# Altium project PulseGenBoard.PrjPcb
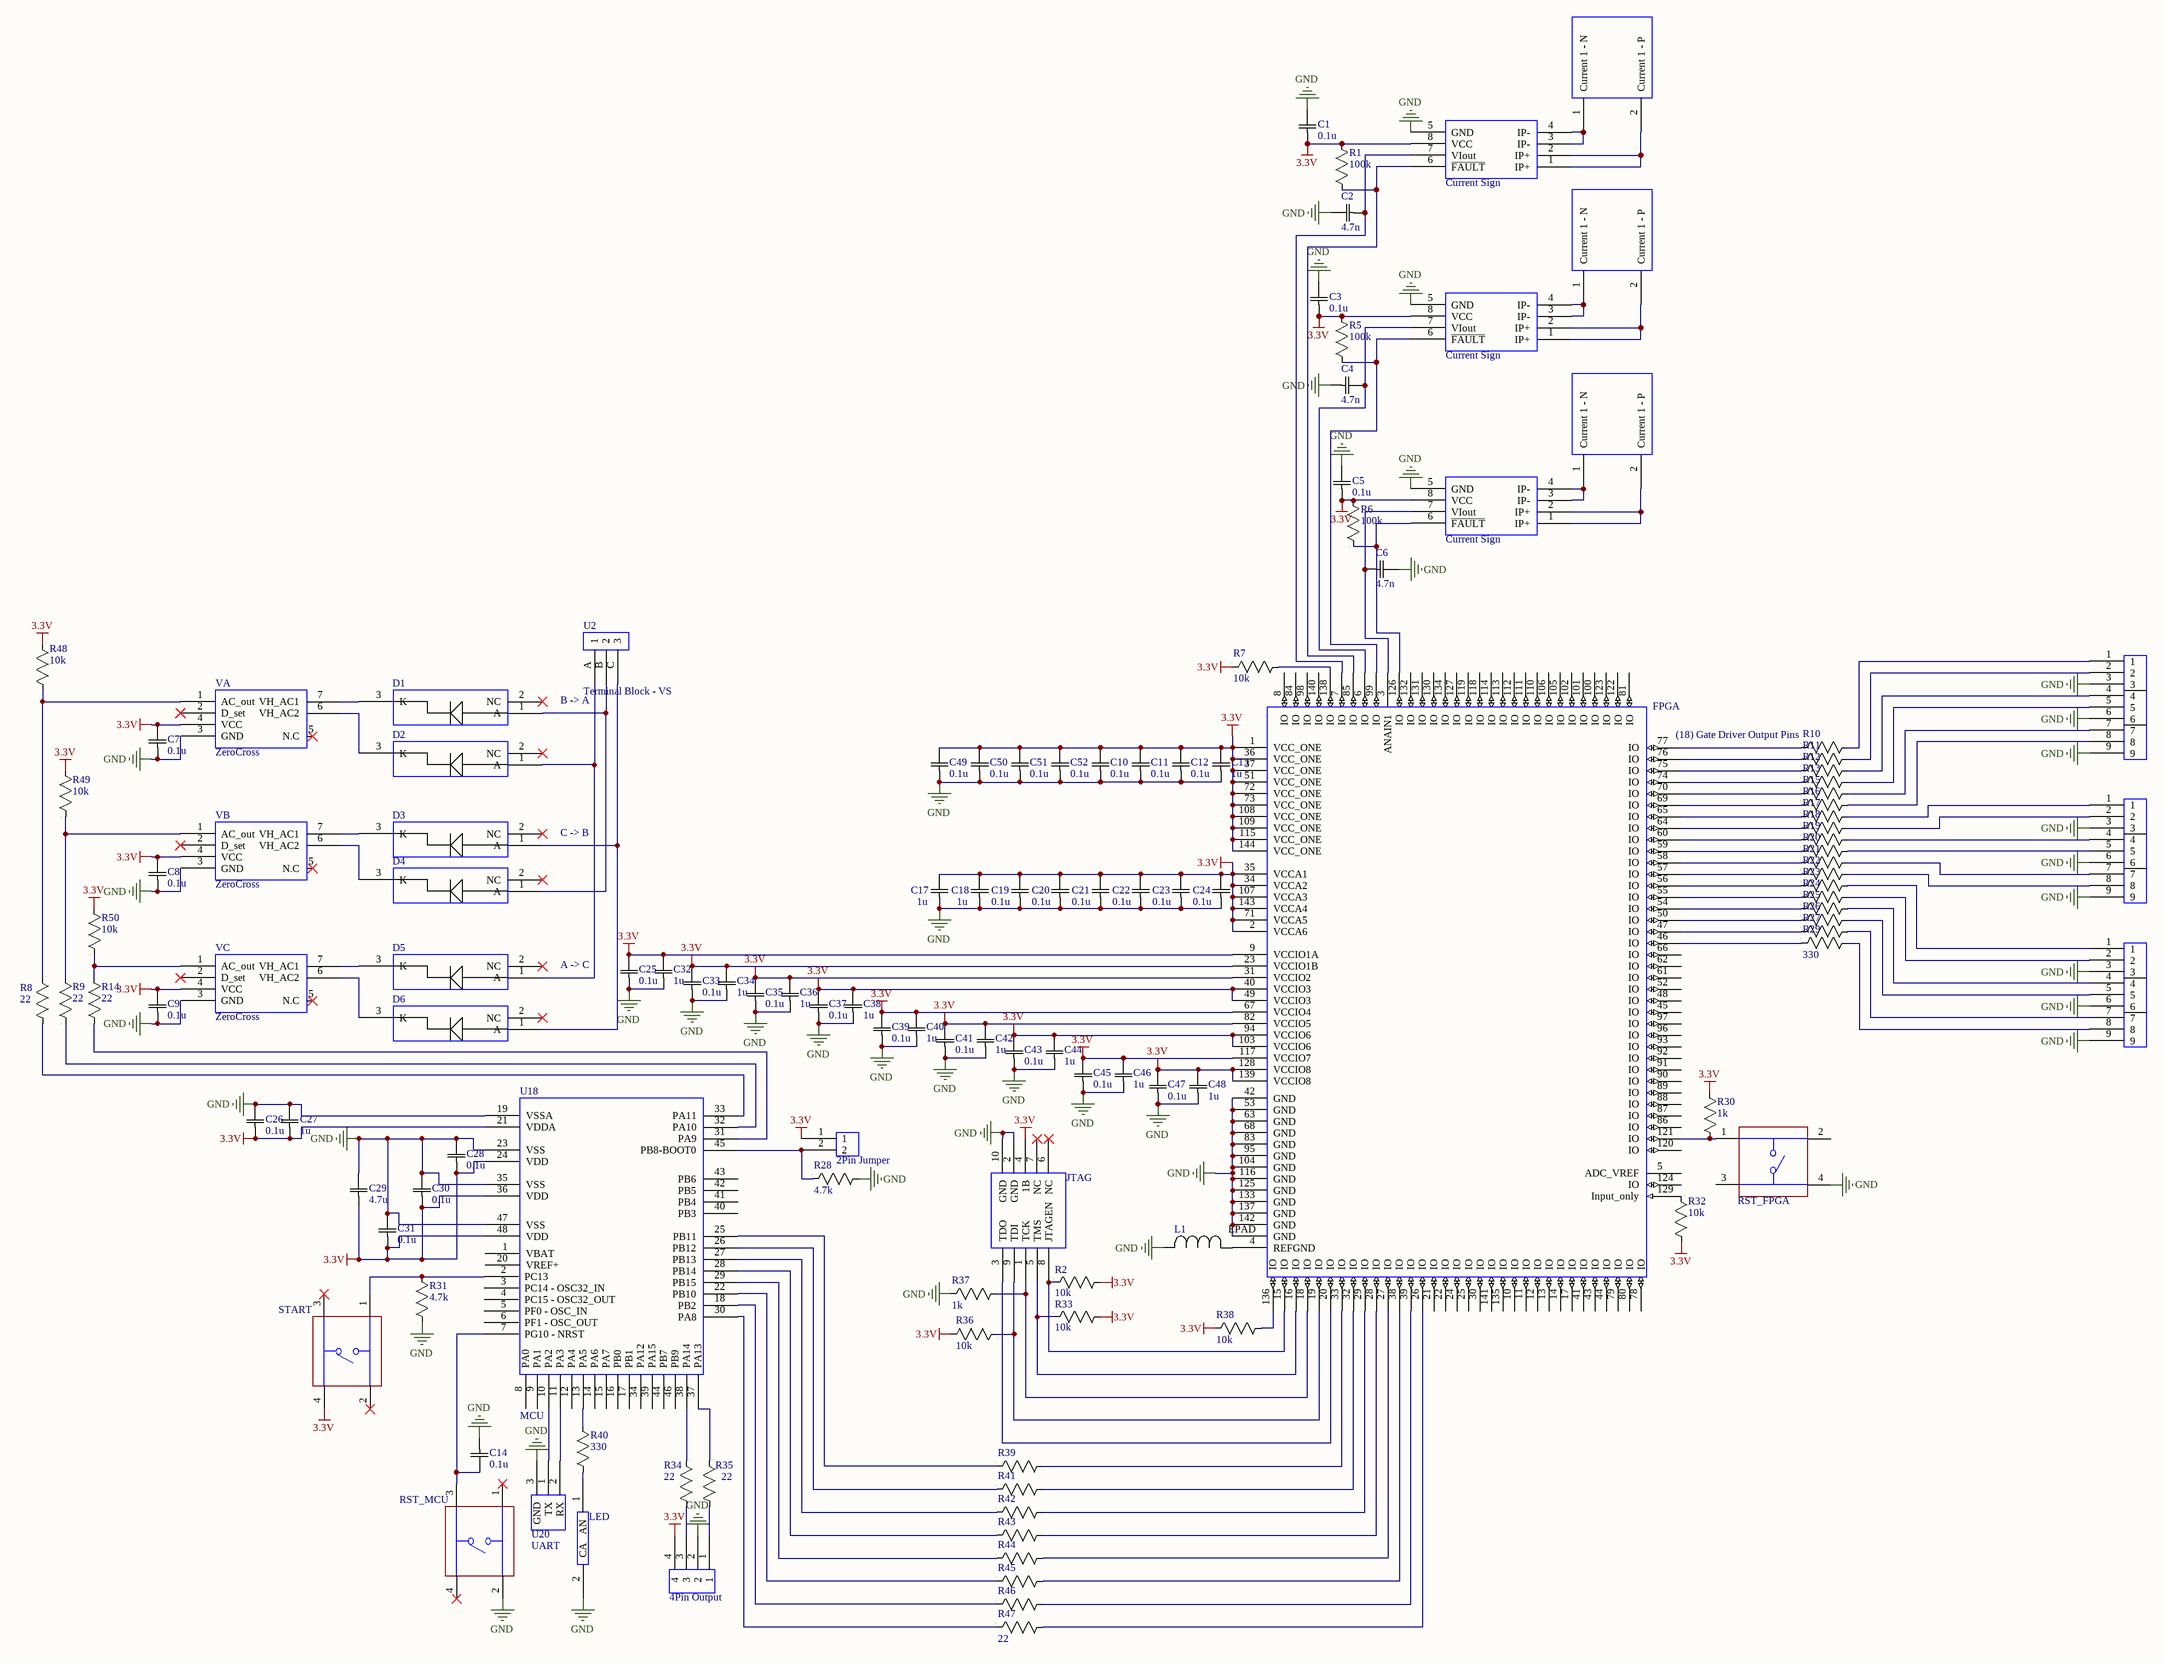
[diagram p0: PulseGen.SchDoc]
2 sheets, 132 parts. Net scope: global (net labels, ports and power ports of the same name join across sheets).
Board file: RevisedPGBoard.PcbDoc
Sheets:
  PulseGen.SchDoc
  15to3.3V.SchDoc

## Sheet PulseGen.SchDoc
size C; SheetNumber: 1; SheetTotal: 2

### Parts
C1  0.1u  [Resistor1]
C2  4.7n  [Resistor1]
C3  0.1u  [Resistor1]
C4  4.7n  [Resistor1]
C5  0.1u  [Resistor1]
C6  4.7n  [Resistor1]
C7  0.1u  [Resistor1]
C8  0.1u  [Resistor1]
C9  0.1u  [Resistor1]
C10  0.1u  [Resistor1]
C11  0.1u  [Resistor1]
C12  0.1u  [Resistor1]
C13  1u  [Resistor1]
C14  0.1u  [Resistor1]
C17  1u  [Resistor1]
C18  1u  [Resistor1]
C19  0.1u  [Resistor1]
C20  0.1u  [Resistor1]
C21  0.1u  [Resistor1]
C22  0.1u  [Resistor1]
C23  0.1u  [Resistor1]
C24  0.1u  [Resistor1]
C25  0.1u  [Resistor1]
C26  0.1u  [Resistor1]
C27  1u  [Resistor1]
C28  0.1u  [Resistor1]
C29  4.7u  [Resistor1]
C30  0.1u  [Resistor1]
C31  0.1u  [Resistor1]
C32  1u  [Resistor1]
C33  0.1u  [Resistor1]
C34  1u  [Resistor1]
C35  0.1u  [Resistor1]
C36  1u  [Resistor1]
C37  0.1u  [Resistor1]
C38  1u  [Resistor1]
C39  0.1u  [Resistor1]
C40  1u  [Resistor1]
C41  0.1u  [Resistor1]
C42  1u  [Resistor1]
C43  0.1u  [Resistor1]
C44  1u  [Resistor1]
C45  0.1u  [Resistor1]
C46  1u  [Resistor1]
C47  0.1u  [Resistor1]
C48  1u  [Resistor1]
C49  0.1u  [Resistor1]
C50  0.1u  [Resistor1]
C51  0.1u  [Resistor1]
C52  0.1u  [Resistor1]
D1  Diode  [Diode1]  (value not drawn)
D2  Diode  [Diode1]  (value not drawn)
D3  Diode  [Diode1]  (value not drawn)
D4  Diode  [Diode1]  (value not drawn)
D5  Diode  [Diode1]  (value not drawn)
D6  Diode  [Diode1]  (value not drawn)
JTAG  JTAG  [JTAG]
L1  Ferrite Bead  [Resistor1]  (value not drawn)
LED  LED  [Resistor1]  (value not drawn)
R1  100k  [Resistor1]
R2  10k  [Resistor1]
R5  100k  [Resistor1]
R6  100k  [Resistor1]
R7  10k  [Resistor1]
R8  22  [Resistor1]
R9  22  [Resistor1]
R10  330  [Resistor1]  (value not drawn)
R11  330  [Resistor1]  (value not drawn)
R12  330  [Resistor1]  (value not drawn)
R13  330  [Resistor1]  (value not drawn)
R14  22  [Resistor1]
R15  330  [Resistor1]  (value not drawn)
R16  330  [Resistor1]  (value not drawn)
R17  330  [Resistor1]  (value not drawn)
R18  330  [Resistor1]  (value not drawn)
R19  330  [Resistor1]  (value not drawn)
R20  330  [Resistor1]  (value not drawn)
R21  330  [Resistor1]  (value not drawn)
R22  330  [Resistor1]  (value not drawn)
R23  330  [Resistor1]  (value not drawn)
R24  330  [Resistor1]  (value not drawn)
R25  330  [Resistor1]  (value not drawn)
R26  330  [Resistor1]  (value not drawn)
R27  330  [Resistor1]  (value not drawn)
R28  4.7k  [Resistor1]
R29  330  [Resistor1]
R30  1k  [Resistor1]
R31  4.7k  [Resistor1]
R32  10k  [Resistor1]
R33  10k  [Resistor1]
R34  22  [Resistor1]
R35  22  [Resistor1]
R36  10k  [Resistor1]
R37  1k  [Resistor1]
R38  10k  [Resistor1]
R39  22  [Resistor1]  (value not drawn)
R40  330  [Resistor1]
R41  22  [Resistor1]  (value not drawn)
R42  22  [Resistor1]  (value not drawn)
R43  22  [Resistor1]  (value not drawn)
R44  22  [Resistor1]  (value not drawn)
R45  22  [Resistor1]  (value not drawn)
R46  22  [Resistor1]  (value not drawn)
R47  22  [Resistor1]
R48  10k  [Resistor1]
R49  10k  [Resistor1]
R50  10k  [Resistor1]
RST_FPGA  Button  [Button]  (value not drawn)
RST_MCU  Button  [Button]  (value not drawn)
START  Button  [Button]  (value not drawn)
U1  Terminal Block - CS  [Terminal Block - CS]  (value not drawn)
U2  Terminal Block - VS  [Terminal Block - VS]
U3  Current Sign  [CurrentSign4]
U4  Terminal Block - CS  [Terminal Block - CS]  (value not drawn)
U5  Current Sign  [CurrentSign4]
U6  Terminal Block - CS  [Terminal Block - CS]  (value not drawn)
U7  Current Sign  [CurrentSign4]
U9  FPGA Output  [FPGA Output]  (value not drawn)
U11  FPGA  [FPGA2]
U13  FPGA Output  [FPGA Output]  (value not drawn)
U14  4Pin Output  [4Pin Output]
U15  FPGA Output  [FPGA Output]  (value not drawn)
U17  2Pin Jumper  [2Pin Jumper]
U18  MCU  [MCU2]
U20  UART  [UART]
VA  ZeroCross  [ZeroCross1]
VB  ZeroCross  [ZeroCross1]
VC  ZeroCross  [ZeroCross1]

### Nets
3.3V: C1.1 C3.1 C5.1 C7.2 C8.2 C9.2 C10.2 C11.2 C12.2 C13.2 C17.2 C18.2 C19.2 C20.2 C21.2 C22.2 C23.2 C24.2 C25.2 C26.1 C27.1 C28.1 C29.1 C30.1 C31.1 C32.2 C33.2 C34.2 C35.2 C36.2 C37.2 C38.2 C39.2 C40.2 C41.2 C42.2 C43.2 C44.2 C45.2 C46.2 C47.2 C48.2 C49.2 C50.2 C51.2 C52.2 JTAG.4(1B) R1.2 R2.2 R5.2 R6.2 R7.?1 R30.2 R32.2 R33.2 R36.2 R38.?1 R48.?1 R49.2 R50.2 START.4 U3.8(VCC) U5.8(VCC) U7.8(VCC) U11.1(VCC_ONE) U11.2(VCCA6) U11.9(VCCIO1A) U11.23(VCCIO1B) U11.31(VCCIO2) U11.34(VCCA2) U11.35(VCCA1) U11.36(VCC_ONE) U11.37(VCC_ONE) U11.40(VCCIO3) U11.49(VCCIO3) U11.51(VCC_ONE) U11.67(VCCIO4) U11.71(VCCA5) U11.72(VCC_ONE) U11.73(VCC_ONE) U11.82(VCCIO5) U11.94(VCCIO6) U11.103(VCCIO6) U11.107(VCCA3) U11.108(VCC_ONE) U11.109(VCC_ONE) U11.115(VCC_ONE) U11.117(VCCIO7) U11.128(VCCIO8) U11.139(VCCIO8) U11.143(VCCA4) U11.144(VCC_ONE) U14.4 U17.1 U18.21(VDDA) U18.24(VDD) U18.36(VDD) U18.48(VDD) VA.4(VCC) VB.4(VCC) VC.4(VCC)
GND: C1.2 C2.2 C3.2 C4.1 C5.2 C6.2 C7.1 C8.1 C9.1 C10.1 C11.1 C12.1 C13.1 C14.1 C17.1 C18.1 C19.1 C20.1 C21.1 C22.1 C23.1 C24.1 C25.1 C26.2 C27.2 C28.2 C29.2 C30.2 C31.2 C32.1 C33.1 C34.1 C35.1 C36.1 C37.1 C38.1 C39.1 C40.1 C41.1 C42.1 C43.1 C44.1 C45.1 C46.1 C47.1 C48.1 C49.1 C50.1 C51.1 C52.1 JTAG.2(GND) JTAG.10(GND) L1.2 LED.2(CA) R28.2 R31.?1 R37.?1 RST_FPGA.4 RST_MCU.2 U3.5(GND) U5.5(GND) U7.5(GND) U9.3 U9.6 U9.9 U11.42(GND) U11.53(GND) U11.63(GND) U11.68(GND) U11.83(GND) U11.95(GND) U11.104(GND) U11.116(GND) U11.125(GND) U11.133(GND) U11.137(GND) U11.142(GND) U11.EPAD(GND) U13.3 U13.6 U13.9 U14.2 U15.3 U15.6 U15.9 U18.19(VSSA) U18.23(VSS) U18.35(VSS) U18.47(VSS) U20.3(GND) VA.3(GND) VB.3(GND) VC.3(GND)
NetC2_1: C2.1 U3.7(VIout) U11.7(IO)
NetC4_2: C4.2 U5.7(VIout) U11.6(IO)
NetC6_1: C6.1 U7.7(VIout) U11.3(ANAIN1)
NetC14_2: C14.2 RST_MCU.3 U18.7(PG10_-_NRST)
NetD1_1: D1.1(A) D4.1(A) U2.B(2)
NetD1_3: D1.3(K) VA.7(VH_AC1)
NetD2_1: D2.1(A) D5.1(A) U2.A(1)
NetD2_3: D2.3(K) VA.6(VH_AC2)
NetD3_1: D3.1(A) D6.1(A) U2.C(3)
NetD3_3: D3.3(K) VB.7(VH_AC1)
NetD4_3: D4.3(K) VB.6(VH_AC2)
NetD5_3: D5.3(K) VC.7(VH_AC1)
NetD6_3: D6.3(K) VC.6(VH_AC2)
NetJTAG_1: JTAG.1(TCK) R37.2 U11.18(IO)
NetJTAG_3: JTAG.3(TDO) U11.20(IO)
NetJTAG_5: JTAG.5(TMS) R33.?1 U11.16(IO)
NetJTAG_8: JTAG.8(JTAGEN) R2.?1 U11.15(IO)
NetJTAG_9: JTAG.9(TDI) R36.?1 U11.19(IO)
NetL1_1: L1.1 U11.4(REFGND)
NetLED_1: LED.1(AN) R40.?1
NetR1_?1: R1.?1 U3.6(~{FAULT}) U11.85(IO)
NetR5_?1: R5.?1 U5.6(~{FAULT}) U11.99(IO)
NetR6_?1: R6.?1 U7.6(~{FAULT}) U11.126(IO)
NetR7_2: R7.2 U11.138(IO)
NetR8_2: R8.2 U18.33(PA11)
NetR8_?1: R8.?1 R48.2 VA.1(AC_out)
NetR9_2: R9.2 R49.?1 VB.1(AC_out)
NetR9_?1: R9.?1 U18.32(PA10)
NetR10_2: R10.2 U9.1
NetR10_?1: R10.?1 U11.77(IO)
NetR11_2: R11.2 U9.2
NetR11_?1: R11.?1 U11.76(IO)
NetR12_2: R12.2 U9.4
NetR12_?1: R12.?1 U11.75(IO)
NetR13_2: R13.2 U9.5
NetR13_?1: R13.?1 U11.74(IO)
NetR14_2: R14.2 R50.?1 VC.1(AC_out)
NetR14_?1: R14.?1 U18.31(PA9)
NetR15_2: R15.2 U9.7
NetR15_?1: R15.?1 U11.70(IO)
NetR16_2: R16.2 U9.8
NetR16_?1: R16.?1 U11.69(IO)
NetR17_2: R17.2 U13.1
NetR17_?1: R17.?1 U11.65(IO)
NetR18_2: R18.2 U13.2
NetR18_?1: R18.?1 U11.64(IO)
NetR19_2: R19.2 U13.4
NetR19_?1: R19.?1 U11.60(IO)
NetR20_2: R20.2 U13.5
NetR20_?1: R20.?1 U11.59(IO)
NetR21_2: R21.2 U13.7
NetR21_?1: R21.?1 U11.58(IO)
NetR22_2: R22.2 U13.8
NetR22_?1: R22.?1 U11.57(IO)
NetR23_2: R23.2 U15.1
NetR23_?1: R23.?1 U11.56(IO)
NetR24_2: R24.2 U15.2
NetR24_?1: R24.?1 U11.55(IO)
NetR25_2: R25.2 U15.4
NetR25_?1: R25.?1 U11.54(IO)
NetR26_2: R26.2 U15.5
NetR26_?1: R26.?1 U11.50(IO)
NetR27_2: R27.2 U15.7
NetR27_?1: R27.?1 U11.47(IO)
NetR28_?1: R28.?1 U17.2 U18.45(PB8-BOOT0)
NetR29_2: R29.2 U15.8
NetR29_?1: R29.?1 U11.46(IO)
NetR30_?1: R30.?1 RST_FPGA.1 U11.121(IO)
NetR31_2: R31.2 START.1 U18.2(PC13)
NetR32_?1: R32.?1 U11.129(Input_only)
NetR34_2: R34.2 U14.3
NetR34_?1: R34.?1 U18.38(PA14)
NetR35_2: R35.2 U14.1
NetR35_?1: R35.?1 U18.37(PA13)
NetR38_2: R38.2 U11.136(IO)
NetR39_2: R39.2 U11.33(IO)
NetR39_?1: R39.?1 U18.25(PB11)
NetR40_2: R40.2 U18.13(PA5)
NetR41_2: R41.2 U11.32(IO)
NetR41_?1: R41.?1 U18.26(PB12)
NetR42_2: R42.2 U11.29(IO)
NetR42_?1: R42.?1 U18.27(PB13)
NetR43_2: R43.2 U11.28(IO)
NetR43_?1: R43.?1 U18.28(PB14)
NetR44_2: R44.2 U11.27(IO)
NetR44_?1: R44.?1 U18.29(PB15)
NetR45_2: R45.2 U11.38(IO)
NetR45_?1: R45.?1 U18.22(PB10)
NetR46_2: R46.2 U11.39(IO)
NetR46_?1: R46.?1 U18.18(PB2)
NetR47_2: R47.2 U11.26(IO)
NetR47_?1: R47.?1 U18.30(PA8)
NetU1_1: U1.1(Current_1_-_N) U3.3(IP-) U3.4(IP-)
NetU1_2: U1.2(Current_1_-_P) U3.1(IP+) U3.2(IP+)
NetU4_1: U4.1(Current_1_-_N) U5.3(IP-) U5.4(IP-)
NetU4_2: U4.2(Current_1_-_P) U5.1(IP+) U5.2(IP+)
NetU6_1: U6.1(Current_1_-_N) U7.3(IP-) U7.4(IP-)
NetU6_2: U6.2(Current_1_-_P) U7.1(IP+) U7.2(IP+)
NetU18_10: U18.10(PA2) U20.1(TX)
NetU18_11: U18.11(PA3) U20.2(RX)

Not connected (* = marked no-connect by the designer): D1 2(NC)*; D2 2(NC)*; D3 2(NC)*; D4 2(NC)*; D5 2(NC)*; D6 2(NC)*; JTAG 6(NC)* 7(NC)*; RST_FPGA 2 3; RST_MCU 1* 4*; START 2* 3*; U11 5(ADC_VREF) 8(IO) 10(IO) 11(IO) 12(IO) 13(IO) 14(IO) 17(IO) 21(IO) 22(IO) 24(IO) 25(IO) 30(IO) 41(IO) 43(IO) 44(IO) 45(IO) 48(IO) 52(IO) 61(IO) 62(IO) 66(IO) 78(IO) 79(IO) 80(IO) 81(IO) 84(IO) 86(IO) 87(IO) 88(IO) 89(IO) 90(IO) 91(IO) 92(IO) 93(IO) 96(IO) 97(IO) 98(IO) 100(IO) 101(IO) 102(IO) 105(IO) 106(IO) 110(IO) 111(IO) 112(IO) 113(IO) 114(IO) 118(IO) 119(IO) 120(IO) 122(IO) 123(IO) 124(IO) 127(IO) 130(IO) 131(IO) 132(IO) 134(IO) 135(IO) 140(IO) 141(IO); U18 1(VBAT) 3(PC14_-_OSC32_IN) 4(PC15_-_OSC32_OUT) 5(PF0_-_OSC_IN) 6(PF1_-_OSC_OUT) 8(PA0) 9(PA1) 12(PA4) 14(PA6) 15(PA7) 16(PB0) 17(PB1) 20(VREF+) 34(PA12) 39(PA15) 40(PB3) 41(PB4) 42(PB5) 43(PB6) 44(PB7) 46(PB9); VA 2(D_set)* 5(N.C)*; VB 2(D_set)* 5(N.C)*; VC 2(D_set)* 5(N.C)*

### Notes on the sheet
- B -> A
- (near R10) (18) Gate Driver Output Pins
- C -> B
- A -> C
- (in symbol Resistor1k) 1
- (in symbol Resistor4.7k) 1
- (in symbol Resistor10k) 1
- (in symbol Resistor22) 1
- (in symbol Resistor100k) 1
- (in symbol Resistor330) 1

### Library data of the parts
C1 C3 C5 C7-C12 C14 C19-C26 C28 C30 C31 C33 C35 C37 C39 C41 C43 C45 C47 C49-C52 = Capacitor0.1u: C0805C104K1RAC7800; Mfr_Name: Murata
C2 C4 C6 = Capacitor4.7n: C0805C472K1GEC7800; Mfr_Name: Murata
C13 C17 C18 C27 C32 C34 C36 C38 C40 C42 C44 C46 C48 = Capacitor1u: C0805C103J1GEC7800; Mfr_Name: Murata
C29 = Capacitor4.7u: C0805C472K1GEC7800; Mfr_Name: Murata
D1-D6 = Diode: Mfr_Name: onsemi; Type: Diodes - Rectifiers, Single; RefDes: RefDes
JTAG = JTAG: JTAG 10 Pin Header
L1 = Ferrite Bead: BLM21BB050SN1D; Mfr_Name: TDK
R1 R5 R6 = Resistor100k: RMCF0805FT100K; Mfr_Name: Stackpole International
R2 R7 R32 R33 R36 R38 R48-R50 = Resistor10k: RMCF0805FT4K70; Mfr_Name: Stackpole International
R8 R9 R14 R34 R35 R39 R41-R47 = Resistor22: RMCF0603JT22R0; Mfr_Name: Stackpole International
R10-R13 R15-R27 R29 R40 = Resistor330: RMCF0805FT330R; Mfr_Name: Stackpole International
R28 R31 = Resistor4.7k: RMCF0805FT4K70; Mfr_Name: Stackpole International
R30 R37 = Resistor1k: RMCF0805FT4K70; Mfr_Name: Stackpole International
RST_FPGA RST_MCU START = Button: SW_TS02-66-60-BK-100-LCR-D; Availability: Unavailable; Price: None; Package: None; MP: TS02-66-60-BK-100-LCR-D; Value: *
U1 U4 U6 = Terminal Block - CS: 8719
U2 = Terminal Block - VS: 8719
U3 U5 U7 = CurrentSign: ACS71240LLCBTR-010B3
U11 = FPGA: 10M04SAE144C8G
U18 = MCU: STM32G491CET6
VA VB VC = ZeroCross: BM1Z003FJ-E2

## Sheet 15to3.3V.SchDoc
size A; SheetNumber: 2; SheetTotal: 2
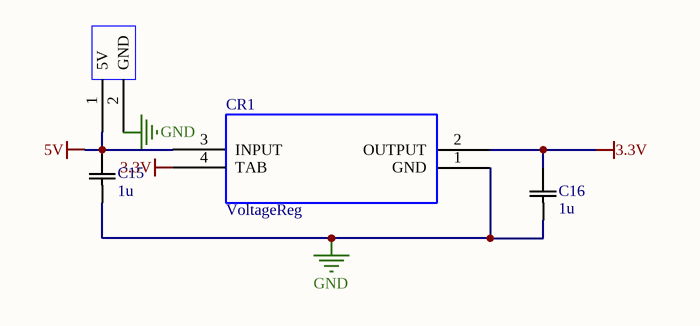
[diagram p1: 15to3.3V.SchDoc]

### Parts
C15  1u  [Resistor1]
C16  1u  [Resistor1]
CR1  VoltageReg  [VoltageReg1]
U21  Input  [Input]  (value not drawn)

### Nets
3.3V: C16.2 CR1.2(OUTPUT) CR1.4(TAB)
5V: C15.2 CR1.3(INPUT) U21.1(5V)
GND: C15.1 C16.1 CR1.1(GND) U21.2(GND)

### Library data of the parts
C15 C16 = Capacitor1u: C0805C103J1GEC7800; Mfr_Name: Murata
CR1 = VoltageReg: LD1117S33TR; Mfr_Name: STMicroelectronics; RefDes: RefDes; Type: Type

## Nets that join several sheets
3.3V: PulseGen (101 pins), 15to3.3V (C16.2 CR1.2 CR1.4)
GND: PulseGen (93 pins), 15to3.3V (C15.1 C16.1 CR1.1 U21.2)